# Altium schematic sheet UV_Sensor.SchDoc
size A; SheetNumber: 7; SheetTotal: 10
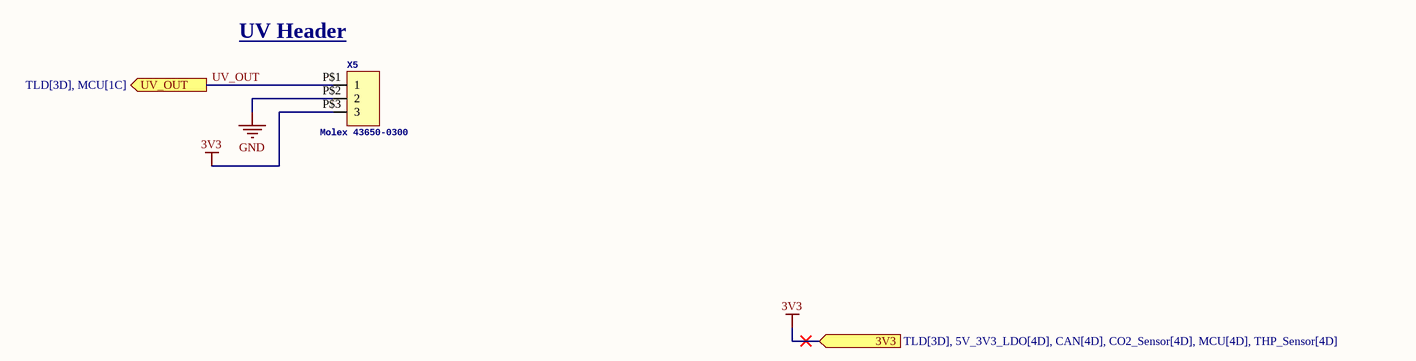
[diagram p0: UV_Sensor.SchDoc]

## Parts
X5  Molex 43650-0300  [43650-0300]

## Ports
3V3 (in, see TLD[3D], 5V_3V3_LDO[4D], CAN[4D], CO2_Sensor[4D], MCU[4D], THP_Sensor[4D]), UV_OUT (out, see TLD[3D], MCU[1C])

## Nets
3V3: X5.P$3(3) ; port 3V3
GND: X5.P$2(2)
UV_OUT: X5.P$1(1) ; port UV_OUT

## Notes on the sheet
- (near X5) UV Header

## Library data of the parts
X5 = Micro-Fit Molex 3 Pin Right Angle: GateName_1: G$1; SymbolName_1: HEADER_POS3; DeviceSetName: HEADER_POS3_?; DeviceName: 43650-0300; LibraryName: con-molex-micro-fit-3_0_2; Package: 43650-0300